# EAGLE design PiCal (EAGLE 6.1)
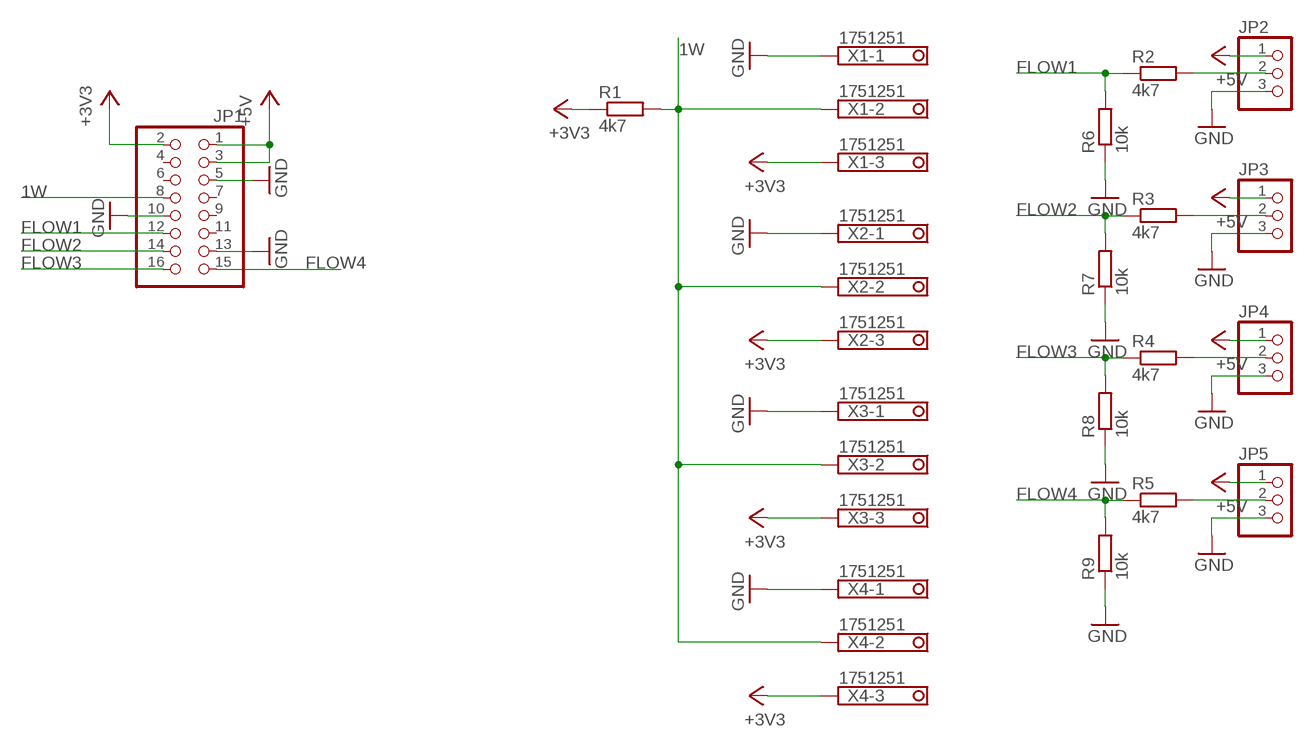
[diagram p0: schematic, sheet 1]

## Parts
JP1  PINHD-2X8  [2X08]
JP2  PINHD-1X3  [1X03]
JP3  PINHD-1X3  [1X03]
JP4  PINHD-1X3  [1X03]
JP5  PINHD-1X3  [1X03]
R1  4k7  R-EU_M0805  [M0805]
R2  4k7  R-EU_M0805  [M0805]
R3  4k7  R-EU_M0805  [M0805]
R4  4k7  R-EU_M0805  [M0805]
R5  4k7  R-EU_M0805  [M0805]
R6  10k  R-EU_M0805  [M0805]
R7  10k  R-EU_M0805  [M0805]
R8  10k  R-EU_M0805  [M0805]
R9  10k  R-EU_M0805  [M0805]
X1  1751251  [1751251]
X2  1751251  [1751251]
X3  1751251  [1751251]
X4  1751251  [1751251]

## Nets
1W: JP1.8 R1.2 X1.2 X2.2 X3.2 X4.2
+3V3: JP1.2 R1.1 X1.3 X2.3 X3.3 X4.3
+5V: JP1.1 JP1.3 JP2.1 JP3.1 JP4.1 JP5.1
FLOW1: JP1.12 R2.1 R6.2
FLOW2: JP1.14 R3.1 R7.2
FLOW3: JP1.16 R4.1 R8.2
FLOW4: JP1.15 R5.1 R9.2
GND: JP1.5 JP1.10 JP1.13 JP2.3 JP3.3 JP4.3 JP5.3 R6.1 R7.1 R8.1 R9.1 X1.1 X2.1 X3.1 X4.1
N$1: JP2.2 R2.2
N$2: JP3.2 R3.2
N$3: JP4.2 R4.2
N$4: JP5.2 R5.2
Unconnected: JP1.4 JP1.6 JP1.7 JP1.9 JP1.11

## Library data of the parts
JP1 = pinhead:PINHD-2X8: PIN HEADER
JP2-JP5 = pinhead:PINHD-1X3: PIN HEADER
R1-R9 = rcl:R-EU_: RESISTOR, European symbol
X1-X4 = con-phoenix-350:1751251: MKDS 1/ 3-3,5 Printklemme Nennstrom: 10 A Bemessungsspannung: 160 V Raster: 3,5 mm Polzahl: 3 Montageart: Löten Anschlussart: Schraubanschluss Anschlussrichtung vom Leiter zur Platine: 0° Source: http://eshop.phoenixcontact.com .. 1751251.pdf; OC_FARNELL: unknown; OC_NEWARK: unknown

## Board
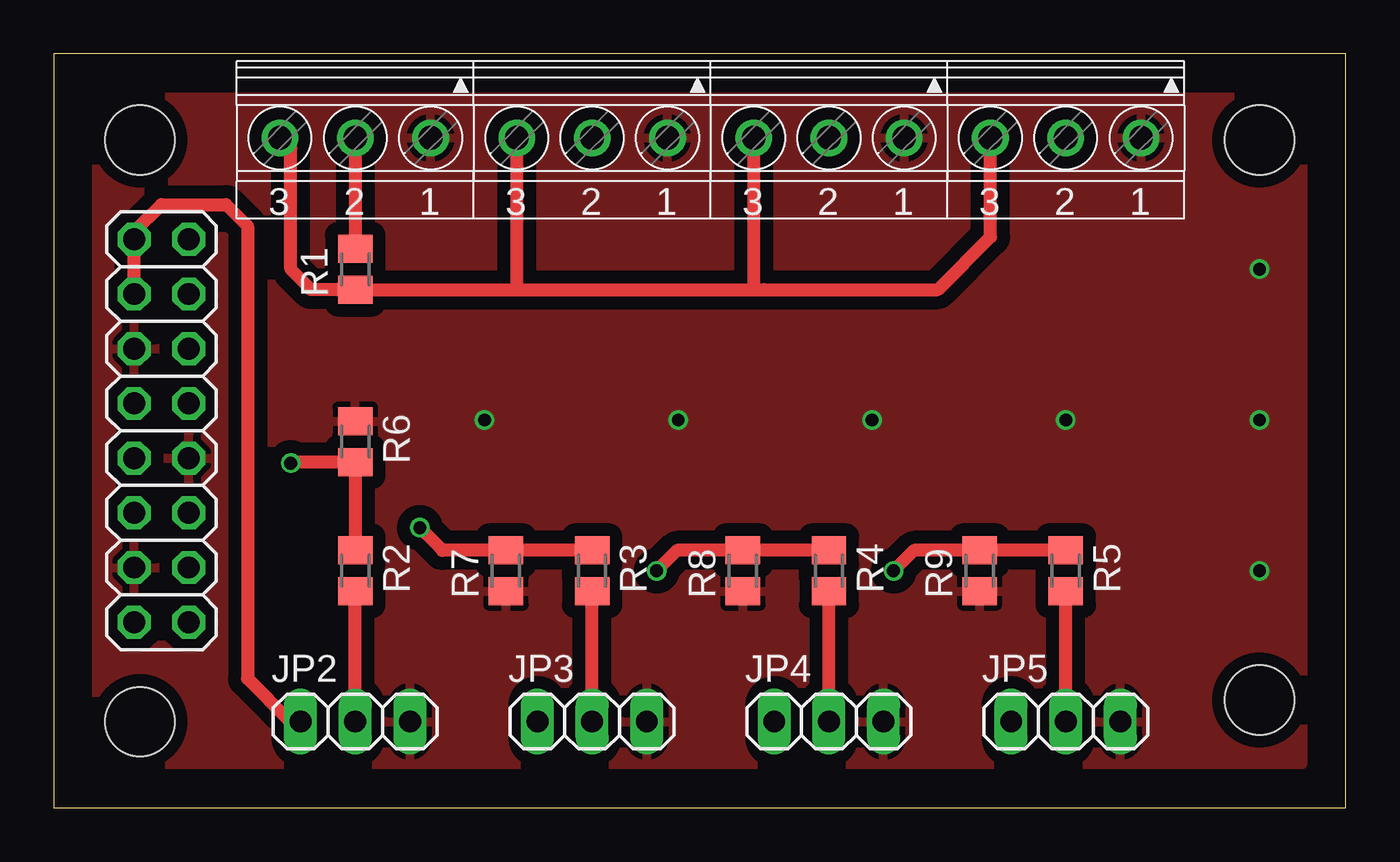
[diagram p1: board, top side]
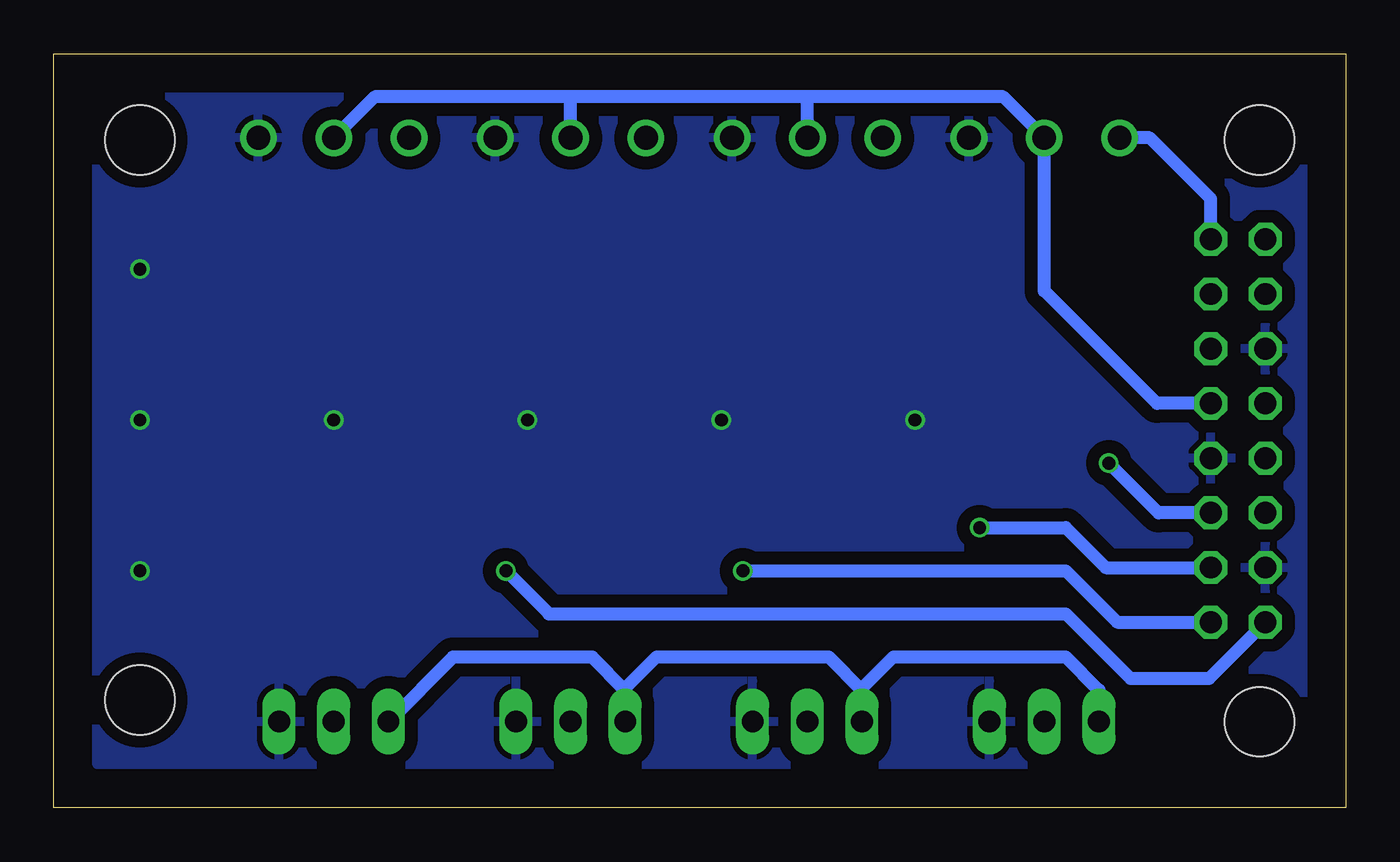
[diagram p2: board, bottom side, seen from below]

Size 60 x 35 mm. Coordinates in mm from the lower left corner, seen from the top.
Outline: 0,0 60,0 60,35 0,35 0,0
Copper layers (1*2*15*16): Top 0.035mm / dielectric 0.2mm / Route2 0.0175mm / dielectric 1.1mm / Route15 0.0175mm / dielectric 0.2mm / Bottom 0.035mm
Design rules: minimum track width 6mil, minimum drill 12mil, track to track 6mil, track to pad 6mil, pad to pad 6mil, via to via 6mil, smd to smd 0mil, copper to edge 10mil, drill to drill 10mil, minimum pad ring 6mil, minimum via ring 6mil, stop-mask expansion 2mil, vias tented up to drill 25mil, thermal gap 10mil
Holes 3.2 mm at 4,31 56,31 56,5 4,4

### Footprints (pad centres in the part's own frame; a part is rotated, then mirrored left to right if it is on the bottom)
2X08 = drill 1.016 octagon: 1 -8.89,-1.27; 2 -8.89,1.27; 3 -6.35,-1.27; 4 -6.35,1.27; 5 -3.81,-1.27; 6 -3.81,1.27; 7 -1.27,-1.27; 8 -1.27,1.27; 9 1.27,-1.27; 10 1.27,1.27; 11 3.81,-1.27; 12 3.81,1.27; 13 6.35,-1.27; 14 6.35,1.27; 15 8.89,-1.27; 16 8.89,1.27
1X03 = drill 1.016 long: 1 -2.54,0; 2 0,0; 3 2.54,0
M0805 = smd 1.3 x 1.6: 1 -0.95,0; 2 0.95,0
1751251 = drill 1.1 pad 1.7: 1 -3.5,-0.1; 2 0,-0.1; 3 3.5,-0.1

### Placement (x,y rotation side)
JP1  5,17.5 270 top
JP2  14,4 0 top
JP3  25,4 0 top
JP4  36,4 0 top
JP5  47,4 0 top
R1  14,25 90 top
R2  14,11 270 top
R3  25,11 270 top
R4  36,11 270 top
R5  47,11 270 top
R6  14,17 270 top
R7  21,11 90 top
R8  32,11 90 top
R9  43,11 90 top
X1  14,31 180 top
X2  25,31 180 top
X3  36,31 180 top
X4  47,31 180 top

### Tracks (layer width: path | path; a pad name or v marks a point on that pad's centre or on a via)
1W
  Top 0.6: X1.2 R1.2
  Bottom 0.6: JP1.8 8.77,18.77 14,24 X1.2 15.9,33 25,33 | 25,33 36,33 | 36,33 45.1,33 X4.2 | X3.2 36,33 | X2.2 25,33
+3V3
  Top 0.6: X1.3 11,30.6 11,25 11.95,24.05 R1.1 21.5,24.05 | 21.5,24.05 32.5,24.05 | X4.3 43.5,26.5 41.05,24.05 33,24.05 32.5,24.05 | X2.3 21.5,24.05 | X3.3 32.5,24.05
  Bottom 0.6: JP1.2 6.27,28.27 9.1,31.1 X1.3
+5V
  Top 0.6: JP2.1 11,4 9,6 9,27 8,28 5,28 3.73,26.73 JP1.1 JP1.3
  Bottom 0.6: JP5.1 41.46,7 35,7 33.46,5.46 JP4.1 33.46,5.54 32,7 24,7 22.46,5.46 JP3.1 22.46,5.54 21,7 13,7 11.46,5.46 JP2.1
FLOW1  (via drill 0.6)
  Top 0.6: R2.1 R6.2 11.05,16.05 v11,16
  Bottom 0.6: JP1.12 8.69,13.69 v11,16
FLOW2  (via drill 0.6)
  Top 0.6: R3.1 R7.2 18.05,11.95 v17,13
  Bottom 0.6: v17,13 13,13 11.15,11.15 JP1.14
FLOW3  (via drill 0.6)
  Top 0.6: R4.1 R8.2 28.95,11.95 v28,11
  Bottom 0.6: v28,11 13,11 10.61,8.61 JP1.16
FLOW4  (via drill 0.6)
  Top 0.6: R5.1 R9.2 39.95,11.95 v39,11
  Bottom 0.6: v39,11 37,9 13,9 10,6 6.34,6 JP1.15
GND  (via drill 0.6)
  other vias: 20,18 29,18 38,18 47,18 56,18 56,25 56,11
  pour Bottom (isolate 0.6): 2,2 58,2 58,33 2,33
  pour Top (isolate 0.6): 2,33 58,33 58,2 2,2
N$1
  Top 0.6: JP2.2 R2.2
N$2
  Top 0.6: JP3.2 R3.2
N$3
  Top 0.6: JP4.2 R4.2
N$4
  Top 0.6: JP5.2 R5.2